# Altium schematic sheet Sheet1.SchDoc
size A4
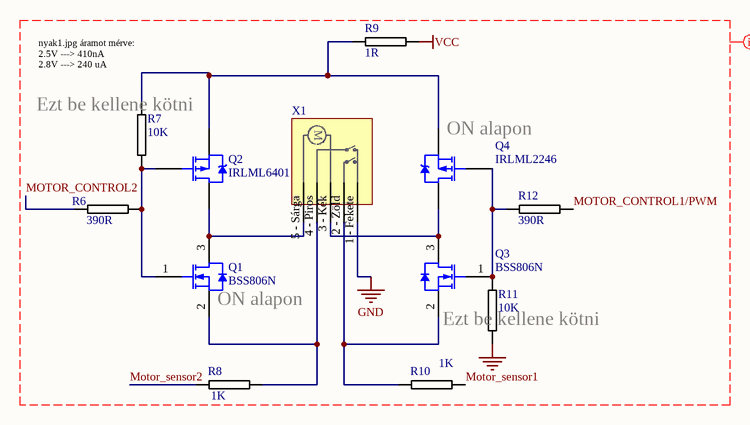
[diagram p0: Sheet1.SchDoc]

## Parts
Q1  BSS806N  [INF-PG-SOT23_N]
Q2  IRLML6401  [Micro3_N]
Q3  BSS806N  [INF-PG-SOT23_N]
Q4  IRLML2246  [Micro3_N]
R6  390R  [0805R-390]
R7  10K  [0805R-10K]
R8  1K  [0805R-1K]
R9  1R  [1206FB-50Z]
R10  1K  [0805R-1K]
R11  10K  [0805R-10K]
R12  390R  [0805R-390]
X1  Component_1  [Szelep_csati]  (value not drawn)

## Nets
GND: R11.2 X1.1_-_Fekete
VCC: R9.2
MOTOR_CONTROL1/PWM: R12.2
MOTOR_CONTROL2: R6.1
Motor_sensor1: R10.2
Motor_sensor2: R8.1
NetQ1_1: Q1.1(GATE) Q2.1(G) R6.2 R7.2
NetQ1_2: Q1.2(SOURCE) R8.2 X1.4_-_Piros
NetQ1_3: Q1.3(DRAIN) Q2.3(D) X1.5_-_Sárga
NetQ2_2: Q2.2(S) Q4.2(S) R7.1 R9.1
NetQ3_1: Q3.1(GATE) Q4.1(G) R11.1 R12.1
NetQ3_2: Q3.2(SOURCE) R10.1 X1.2_-_Zöld
NetQ3_3: Q3.3(DRAIN) Q4.3(D) X1.3_-_Kék

## Layout directives
net class H-Bridge: GND, MOTOR_CONTROL1/PWM, MOTOR_CONTROL2, Motor_sensor1, Motor_sensor2, VCC

## Notes on the sheet
- (near R7) Ezt be kellene kötni
- (near R7) nyak1.jpg áramot mérve:
  2.5V ---> 410nA
  2.8V ---> 240 uA
- (near Q4) ON alapon
- (near Q1) ON alapon
- (near R11) Ezt be kellene kötni
- (in symbol szelep_csati1) M

## Library data of the parts
Q1 Q3 = BSS806N: N-Channel OptiMOS 2 Small-Signal-Transistor, 20 V VDS, 2.3 A ID, -55 to 150 degC, PG-SOT23, Reel, Green; Manufacturer: Infineon; Green: TRUE; ID (max): 2.3 A; IDpuls (max): 9.3 A; Ptot (max): 0.5 W; QG: 1.7 nC; RDS (on) (max): 57 mOhm; RDS (on) (max) (@1.8V): 82 mOhm; RthJA (max): 250 K/W; VDS (max): 20 V; VGS(th) (max): 0.75 V; VGS(th) (min): 0.3 V; DatasheetVersion: Rev. 2.3; PackageVersion: Apr-08; PackageReference: PG-SOT23; PackageDescription: 3-Pin Small Outline Transistor Package, 2.9 x 1.3 mm Body, 0.95 mm Pitch; Halogen-free: TRUE; Packing: Reel; RDS (on) (max) (@2.5V): 57 mOhm; Mounting Technology: Surface Mount; PartNumber: BSS806N; ComponentLink1Description: Manufacturer URL; ComponentLink1URL: http://www.infineon.com/; ComponentLink2Description: Datasheet; ComponentLink2URL: http://www.infineon.com/dgdl/BSS806N_Rev2.3_.pdf?folderId=db3a3043156fd573011622e10b5c1f67&fileId=db3a304330f686060131185f0553451c; ComponentLink3Description: Package Specification; ComponentLink3URL: http://www.infineon.com/dgdl/SOT23-Package_Overview.pdf?folderId=db3a30431936bc4b0119532290053c66&fileId=db3a30431936bc4b0119533468123c85
Q2 Q4 = IRLML6401: HEXFET Power MOSFET; Published: 17-Sep-2003; DatasheetVersion: 2-Jul-2001; PackageVersion: Jul-2001; PackageReference: Micro3; Publisher: Altium Limited; PackageDescription: 3-Pin SOT-23 Package 0.95 mm Pitch, 2.3 mm Lead Span; ComponentLink1Description: Manufacturer Link; ComponentLink1URL: http://www.irf.com/; ComponentLink2Description: Datasheet; ComponentLink2URL: http://www.irf.com/product-info/datasheets/data/IRLML6401.pdf
R6 R12 = 0805R-390: RESISTOR 0805 1/4 WATT THIN FILM; Reel: *
R7 R11 = 0805R-10K: RESISTOR 0805 1/4 WATT THIN FILM; Reel: *
R8 R10 = 0805R-1K: RESISTOR 0805 1/4 WATT THIN FILM; Reel: *
R9 = 0805R-1R: RESISTOR 0805 1/3 WATT; REEL: R84; Supplier 1: Digi-Key; Supplier Part Number 1: 541-1.0TADKR-ND
X1 = szelep_csati1